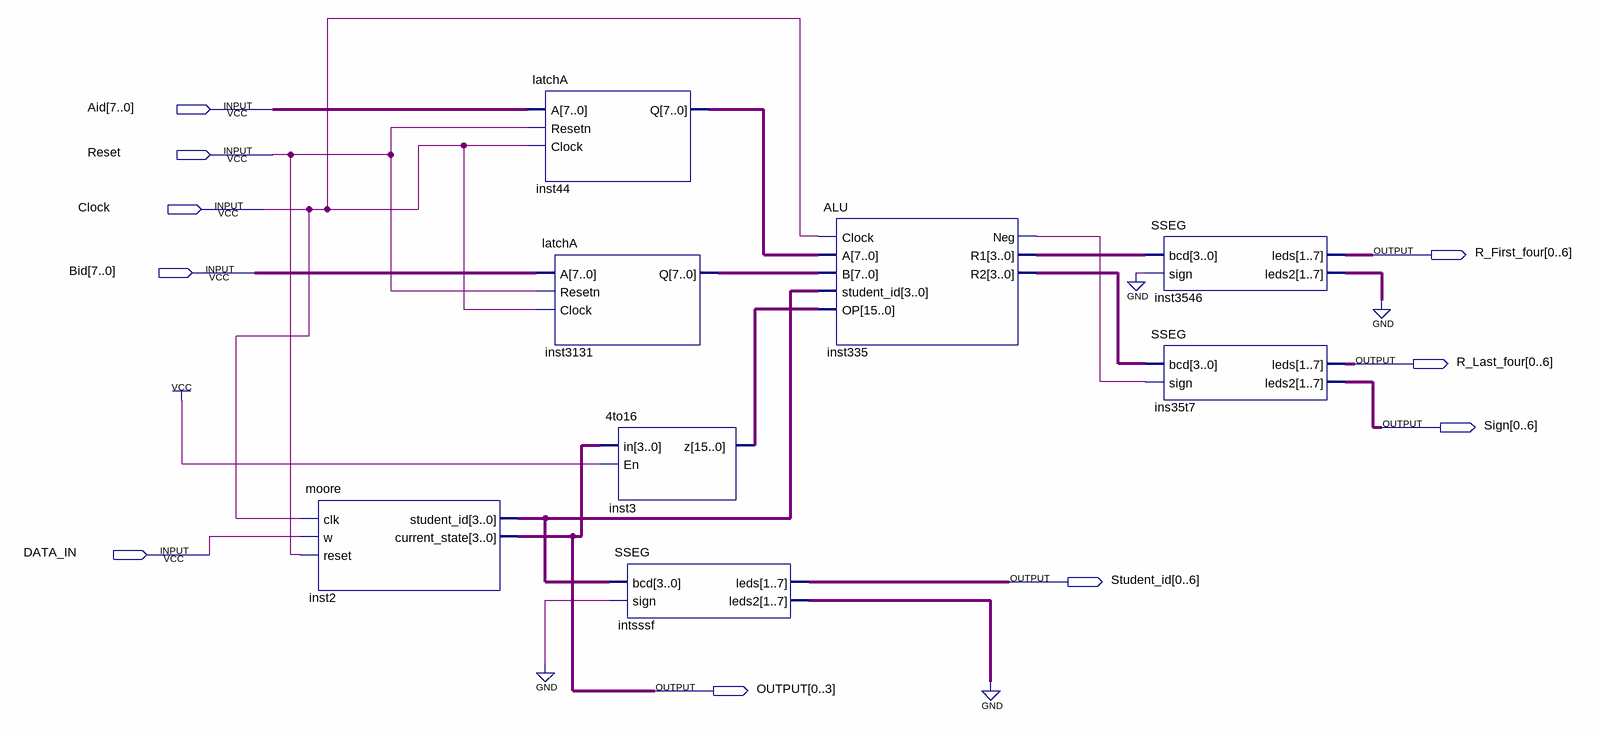
[diagram p0: schematic sheet]
// Quartus schematic GPU.bdf as structural Verilog: 8 symbols, 10 pins
module GPU (
  input  [7:0] Aid,
  input  Reset,
  input  Clock,
  input  [7:0] Bid,
  input  DATA_IN,
  output [0:6] R_First_four,
  output [0:6] R_Last_four,
  output [0:6] Sign,
  output [0:6] Student_id,
  output [0:3] OUTPUT
);

  wire inst335_neg;
  wire [3:0] inst2_student_id, inst335_r1, inst335_r2;
  wire [6:0] inst3546_leds2, intsssf_leds2;
  wire [7:0] inst44_q, inst3131_q;
  wire [15:0] inst3_z;

  moore inst2 (.clk(Clock), .w(DATA_IN), .reset(Reset), .student_id(inst2_student_id), .current_state(OUTPUT));
  latchA inst44 (.A(Aid), .Resetn(Reset), .Clock(Clock), .Q(inst44_q));
  latchA inst3131 (.A(Bid), .Resetn(Reset), .Clock(Clock), .Q(inst3131_q));
  \4to16  inst3 (.in(OUTPUT), .En(1'b1), .z(inst3_z));
  SSEG intsssf (.bcd(inst2_student_id), .sign(1'b0), .leds(Student_id), .leds2(intsssf_leds2));
  ALU inst335 (
    .Clock(Clock), .A(inst44_q), .B(inst3131_q), .student_id(inst2_student_id), .OP(inst3_z),
    .Neg(inst335_neg), .R1(inst335_r1), .R2(inst335_r2));
  SSEG inst3546 (.bcd(inst335_r1), .sign(1'b0), .leds(R_First_four), .leds2(inst3546_leds2));
  SSEG ins35t7 (.bcd(inst335_r2), .sign(inst335_neg), .leds(R_Last_four), .leds2(Sign));
  // also tied to GND on the sheet: {intsssf_leds2[0], intsssf_leds2[1], intsssf_leds2[2], intsssf_leds2[3], intsssf_leds2[4], intsssf_leds2[5], intsssf_leds2[6], inst3546_leds2[0], inst3546_leds2[1], inst3546_leds2[2], inst3546_leds2[3], inst3546_leds2[4], inst3546_leds2[5], inst3546_leds2[6]}
endmodule
